# EAGLE schematic original (EAGLE 8.1.0)
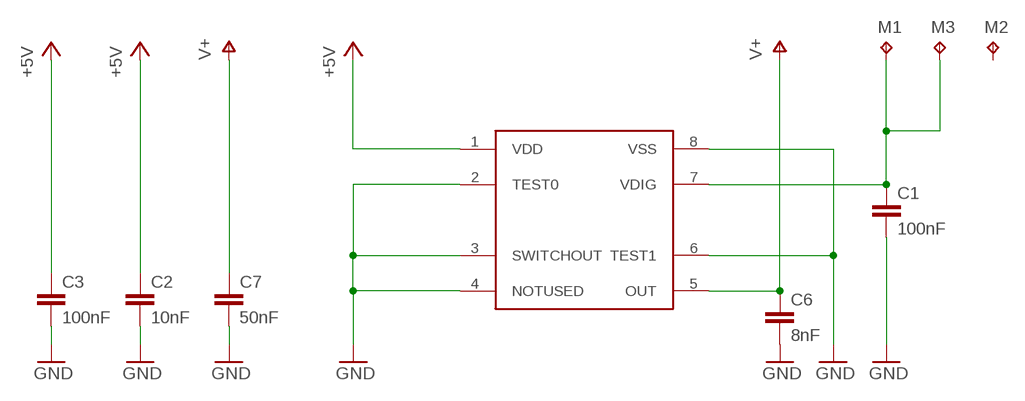
[diagram p0: schematic, sheet 1]

## Parts
C1  100nF  C-EUC0805K  [C0805K]
C2  10nF  C-EUC0603K  [C0603K]
C3  100nF  C-EUC0805K  [C0805K]
C6  8nF  C-EUC0603K  [C0603K]
C7  50nF  C-EUC0603K  [C0603K]
M1  TPB1,27  [B1,27]
M2  TPB1,27  [B1,27]
M3  TPB1,27  [B1,27]
U$1  MLX90316  [SO-08]

## Nets
+5V: C2.1 C3.1 U$1.1(VDD)
GND: C1.2 C2.2 C3.2 C6.2 C7.2 U$1.2(TEST0) U$1.3(SWITCHOUT) U$1.4(NOTUSED) U$1.6(TEST1) U$1.8(VSS)
N$1: C1.1 M1.TP M3.TP U$1.7(VDIG)
V+: C6.1 C7.1 U$1.5(OUT)
Unconnected: M2.TP

## Library data of the parts
C1-C3 C6 C7 = rcl:C-EU: CAPACITOR, European symbol
M1-M3 = testpad:TP: Test pad
U$1 = MLX90316:MLX90316